# EAGLE design m1-program-counter (EAGLE 9.5.2)
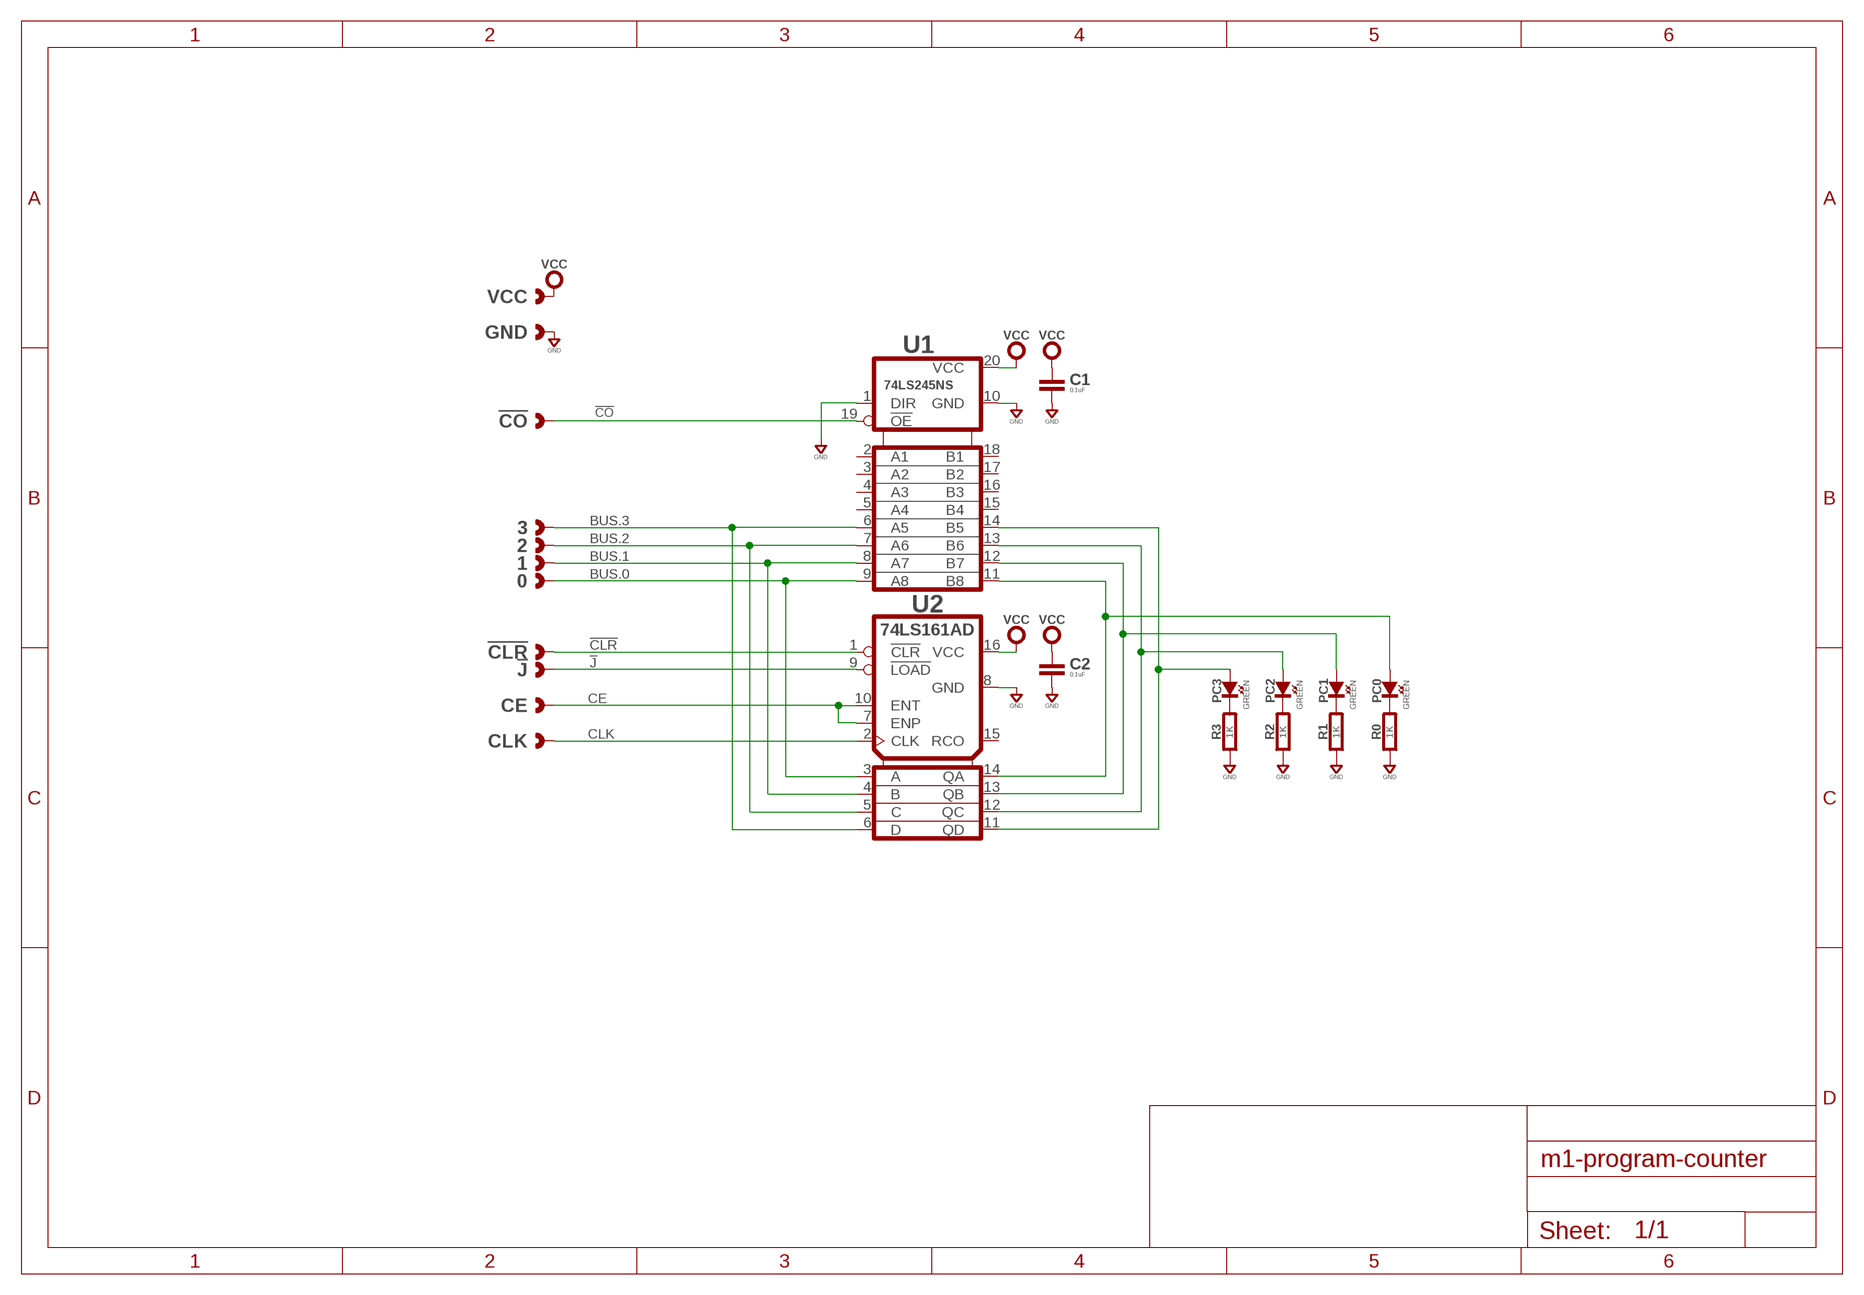
[diagram p0: schematic, sheet 1]

## Parts
0  CAST-01X1  [CAST01-2.54MM]
1  CAST-01X1  [CAST01-2.54MM]
2  CAST-01X1  [CAST01-2.54MM]
3  CAST-01X1  [CAST01-2.54MM]
!CLR  CAST-01X1  [CAST01-2.54MM]
!CO  CAST-01X1  [CAST01-2.54MM]
!J  CAST-01X1  [CAST01-2.54MM]
C1  0.1uF  CAPACITOR0603  [0603-CAP]
C2  0.1uF  CAPACITOR0603  [0603-CAP]
CE  CAST-01X1  [CAST01-2.54MM]
CLK  CAST-01X1  [CAST01-2.54MM]
GND  CAST-01X1  [CAST01-2.54MM]
PC0  GREEN  SMT0603  [SMD_0603]
PC1  GREEN  SMT0603  [SMD_0603]
PC2  GREEN  SMT0603  [SMD_0603]
PC3  GREEN  SMT0603  [SMD_0603]
R0  1K  RESISTOR0603  [0603-RES]
R1  1K  RESISTOR0603  [0603-RES]
R2  1K  RESISTOR0603  [0603-RES]
R3  1K  RESISTOR0603  [0603-RES]
U1  74LS245NS  [SO20]
U2  74LS161AD  [SO16]
VCC  CAST-01X1  [CAST01-2.54MM]

## Nets
!CLR: !CLR.1 U2.1(!CLR)
!CO: !CO.1 U1.19(!OE)
!J: !J.1 U2.9(!LOAD)
BUS.0: 0.1 U1.9(A8) U2.3(A)
BUS.1: 1.1 U1.8(A7) U2.4(B)
BUS.2: 2.1 U1.7(A6) U2.5(C)
BUS.3: 3.1 U1.6(A5) U2.6(D)
CE: CE.1 U2.7(ENP) U2.10(ENT)
CLK: CLK.1 U2.2(CLK)
GND: C1.2 C2.2 GND.1 R0.1 R1.1 R2.1 R3.1 U1.1(DIR) U1.10(GND) U2.8(GND)
N$1: PC0.A U1.11(B8) U2.14(QA)
N$2: PC1.A U1.12(B7) U2.13(QB)
N$3: PC2.A U1.13(B6) U2.12(QC)
N$4: PC3.A U1.14(B5) U2.11(QD)
N$9: PC0.K(C) R0.2
N$15: PC1.K(C) R1.2
N$16: PC2.K(C) R2.2
N$17: PC3.K(C) R3.2
VCC: C1.1 C2.1 U1.20(VCC) U2.16(VCC) VCC.1
Unconnected: U1.2(A1) U1.3(A2) U1.4(A3) U1.5(A4) U1.15(B4) U1.16(B3) U1.17(B2) U1.18(B1) U2.15(RCO)

## Library data of the parts
0 1-3 !CLR !CO !J CE CLK GND VCC = con-headers:CAST-01X1: Castelated Edge Hole Pad
C1 C2 = rlc:CAPACITOR: Capacitor CAP
PC0 PC1-PC3 = led:SMT: LED SMT
R0 R1-R3 = rlc:RESISTOR: Resistor
U1 = logic:74*245?: 74245 Octal Transceiver
U2 = logic:74*161A?: Synchronous 4-bit Counter

## Board
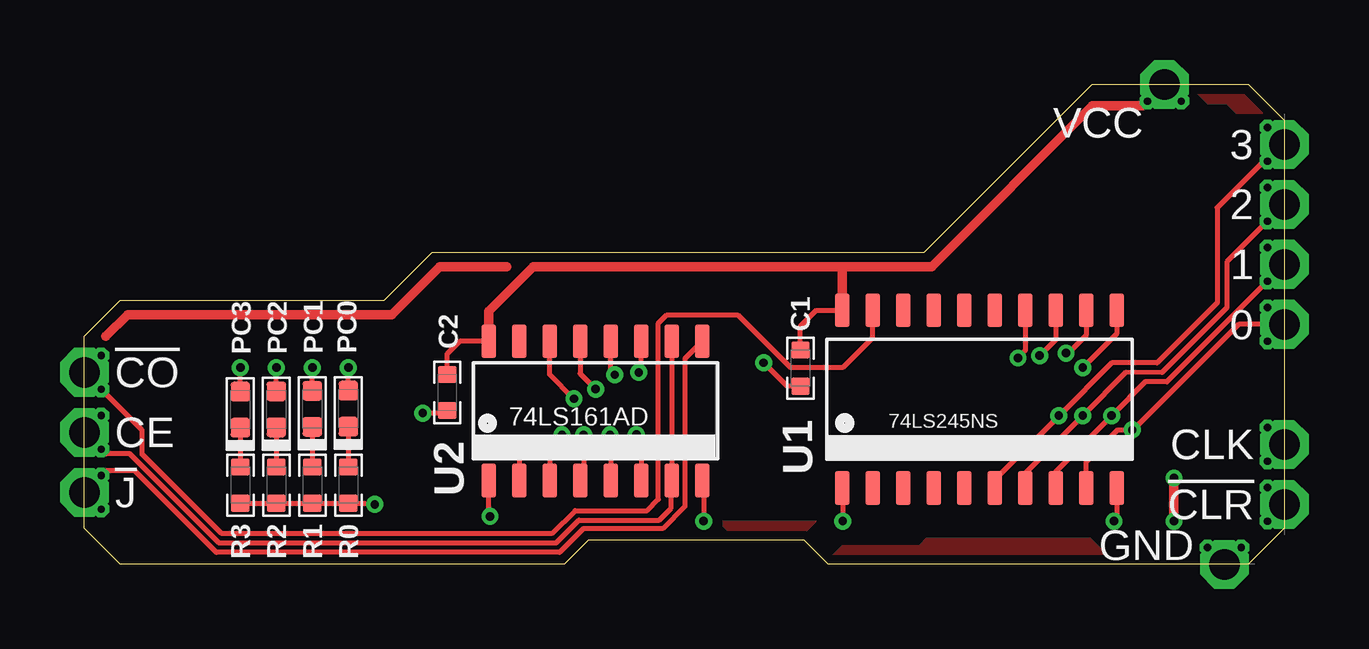
[diagram p1: board, top side]
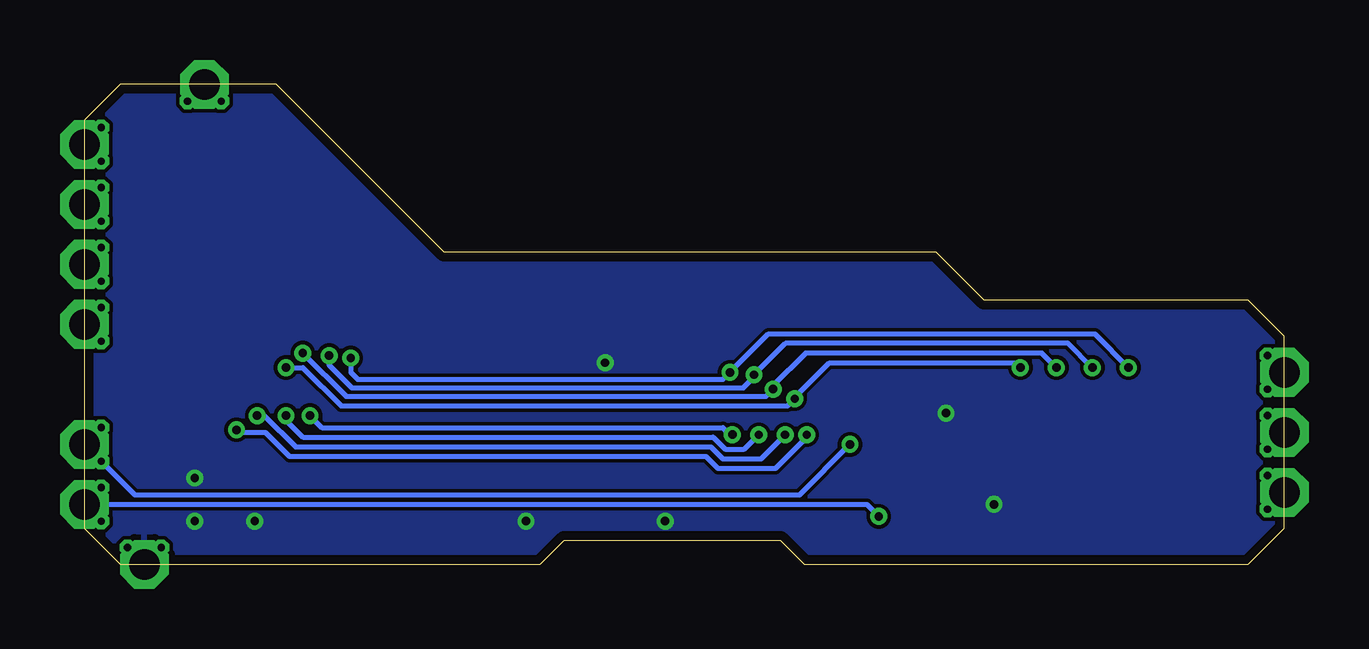
[diagram p2: board, bottom side, seen from below]

Size 50 x 20 mm. Coordinates in mm from the lower left corner, seen from the top.
Outline: 48.5,0 47.5,0 31,0 30,1 21,1 20,0 1.5,0 0,1.5 0,3 0,5.5 0,8 0,9.5 1.5,11 12.5,11 14.5,13 35,13 42,20 45,20 48.5,20 50,18.5 50,17.5 50,15 50,12.5 50,10 50,5 50,2.5 50,1.5 48.5,0
Copper layers (1*16): Top 0.0356mm / dielectric 1.5011mm / Bottom 0.0356mm
Design rules "OSH-CircuitMonkey *": minimum track width 6mil, minimum drill 13mil, track to track 6mil, track to pad 6mil, pad to pad 6mil, via to via 6mil, smd to smd 6mil, copper to edge 15mil, drill to drill 6mil, minimum pad ring 7mil, minimum via ring 7mil, stop-mask expansion 3mil, vias tented up to drill 14mil, thermal gap 10mil

### Footprints (pad centres in the part's own frame; a part is rotated, then mirrored left to right if it is on the bottom)
CAST01-2.54MM = drill 1.27 pad 2.032 octagon: 1 0,0 | drill 0.305 octagon: P$1 -0.7,0.7; P$2 -0.7,-0.7
0603-CAP = smd 0.711 x 0.762: 1 -0.752,0; 2 0.752,0
SMD_0603 = smd 0.8 x 0.8: A 0.75,0; K -0.75,0
0603-RES = smd 0.711 x 0.762: 1 -0.752,0; 2 0.752,0
SO20 = smd 0.6 x 1.4: 1 -5.715,-3.7; 2 -4.445,-3.7; 3 -3.175,-3.7; 4 -1.905,-3.7; 5 -0.635,-3.7; 6 0.635,-3.7; 7 1.905,-3.7; 8 3.175,-3.7; 9 4.445,-3.7; 10 5.715,-3.7; 11 5.715,3.7; 12 4.445,3.7; 13 3.175,3.7; 14 1.905,3.7; 15 0.635,3.7; 16 -0.635,3.7; 17 -1.905,3.7; 18 -3.175,3.7; 19 -4.445,3.7; 20 -5.715,3.7
SO16 = smd 0.6 x 1.4: 1 -4.445,-2.9; 2 -3.175,-2.9; 3 -1.905,-2.9; 4 -0.635,-2.9; 5 0.635,-2.9; 6 1.905,-2.9; 7 3.175,-2.9; 8 4.445,-2.9; 9 4.445,2.9; 10 3.175,2.9; 11 1.905,2.9; 12 0.635,2.9; 13 -0.635,2.9; 14 -1.905,2.9; 15 -3.175,2.9; 16 -4.445,2.9

### Placement (x,y rotation side)
0  50,10 0 top
1  50,12.5 0 top
2  50,15 0 top
3  50,17.5 0 top
!CLR  50,2.5 0 top
!CO  0,8 180 top
!J  0,3 180 top
C1  29.84,8.18 270 top
C2  15.12,7.16 270 top
CE  0,5.5 180 top
CLK  50,5 0 top
GND  47.5,0 270 top
PC0  11,6.49 90 top
PC1  9.5,6.48 90 top
PC2  8,6.46 90 top
PC3  6.5,6.45 90 top
R0  11,3.3 90 top
R1  9.5,3.3 90 top
R2  8,3.3 90 top
R3  6.5,3.3 90 top
U1  37.29,6.89 0 top
U2  21.29,6.4 0 top
VCC  45,20 90 top

### Tracks (layer width: path | path; a pad name or v marks a point on that pad's centre or on a via)
!CLR  (via drill 0.35)
  Top 0.2: v16.9,2 16.85,2.05 U2.1
  Bottom 0.2: !CLR.1 17.4,2.5 v16.9,2
!CO
  Top 0.2: !CO.1 2.4,5.6 2.4,4.6 5.7,1.3 19.5,1.3 20.44,2.24 23.45,2.24 23.91,2.71 23.91,10.05 24.27,10.4 27.22,10.4 29.41,8.22 31.62,8.22 32.85,9.45 U1.19
!J
  Top 0.2: U2.9 25.02,8.58 25.02,2.42 24.09,1.49 20.79,1.49 19.8,0.5 5.5,0.5 2.1,3.9 0.9,3.9 !J.1
AAA
  pour Top: 26.8,1.4 30.1,1.4 30.5,1.8 26.6,1.8 26.6,1.6
BBB
  pour Top: 49.1,18.8 48.3,19.6 46.4,19.6 46.8,19.2 47.6,19.2 48,18.8
BUS.0  (via drill 0.35)
  Top 0.2: 0.1 48.1,10 43.7,5.61 v43.66,5.61 43.06,5.61 41.74,4.28 U1.9 | v19.9,5.4 19.39,4.89 U2.3
  Bottom 0.2: v43.66,5.61 43.56,5.5 42.46,5.5 41.46,4.5 24.1,4.5 23.6,4 21.2,4 19.9,5.3 v19.9,5.4
BUS.1  (via drill 0.35)
  Top 0.2: 1.1 45.1,7.6 44.2,7.6 v42.8,6.2 40.49,3.89 40.49,3.21 U1.8 | v20.8,5.4 20.8,3.64 U2.4
  Bottom 0.2: v42.8,6.2 42.5,6.2 41.2,4.9 23.9,4.9 23.4,4.4 21.8,4.4 v20.8,5.4
BUS.2  (via drill 0.35)
  Top 0.2: 2.1 47.6,12.6 47.6,10.7 44.89,7.99 43.4,8 v41.6,6.2 39.2,3.8 U1.7 | v21.9,5.4 21.93,5.37 U2.5
  Bottom 0.2: v41.6,6.2 41.6,6 40.9,5.3 23.8,5.3 23.3,4.8 22.5,4.8 v21.9,5.4
BUS.3  (via drill 0.35)
  Top 0.2: 3.1 49.84,17.5 47.2,14.86 47.2,10.9 44.7,8.4 42.81,8.4 40.61,6.2 | 40.61,6.2 37.9,3.49 37.9,3.21 U1.6 | v40.6,6.2 40.61,6.2 | v23,5.41 23.2,5.21 U2.6
  Bottom 0.2: v40.6,6.2 40.1,5.7 23.39,5.7 23.1,5.41 v23,5.41
CE
  Top 0.2: CE.1 0.9,4.6 1.9,4.6 5.61,0.9 19.65,0.9 20.6,1.84 23.95,1.84 24.45,2.34 24.45,3.48 U2.7 U2.10
CLK  (via drill 0.35)
  Top 0.2: v18.1,5 18.12,4.98 U2.2
  Bottom 0.2: CLK.1 47.9,2.9 20.2,2.9 v18.1,5
GND  (via drill 0.35)
  Top 0.2: C2.2 15.01,6.3 v14.1,6.3 | v28.3,8.4 29.28,7.42 C1.2 | U1.1 31.6,3.17 v31.6,1.8 | U2.8 25.8,3.43 v25.8,1.8 | U1.10 43.01,1.91 v42.9,1.8 | R3.1 R2.1 R1.1 R0.1 12.05,2.55 v12.1,2.5
  Top 0.4: v45.4,3.6 v45.4,1.8
  pour Bottom: 1.5,0 0,1.5 0,9.5 1.5,11 12.5,11 14.5,13 35,13 42,20 48.5,20 50,18.5 50,1.5 48.5,0 31,0 30,1 21,1 20,0
N$1  (via drill 0.35)
  Top 0.2: U1.11 43.01,9.61 v41.6,8.2 | v20.4,6.9 19.39,7.91 U2.14 | PC0.A v11,8.2
  Bottom 0.2: v41.6,8.2 40.9,8.2 39.3,6.6 20.7,6.6 v20.4,6.9 20.4,6.96 18.96,8.4 11.2,8.4 v11,8.2
N$2  (via drill 0.35)
  Top 0.2: U1.12 41.74,9.54 40.9,8.7 v40.9,8.8 | U2.13 20.66,7.94 v21.3,7.3 | PC1.A v9.5,8.2
  Bottom 0.2: v40.9,8.8 39.09,7 21.6,7 v21.3,7.3 21.3,7.46 19.95,8.8 10.11,8.8 v9.5,8.2
N$3  (via drill 0.35)
  Top 0.2: U1.13 40.47,9.37 v39.8,8.7 | v22.1,7.9 21.93,8.07 U2.12 | PC2.A v8,8.2
  Bottom 0.2: v39.8,8.7 39.8,8.3 38.86,7.36 22.54,7.36 22.1,7.8 v22.1,7.9 20.8,9.21 9.01,9.21 v8,8.2
N$4  (via drill 0.35)
  Top 0.2: U1.14 39.2,8.9 v38.9,8.6 | v23.1,8 23.2,8.1 U2.11 | PC3.A v6.5,8.2
  Bottom 0.2: v38.9,8.6 38.9,8 38.61,7.71 23.39,7.71 v23.1,8 21.5,9.6 7.9,9.6 v6.5,8.2
N$5
  Top 0.4: 17.6,12.4 14.8,12.4 12.8,10.4 1.8,10.4 0.9,9.5
N$9
  Top 0.2: PC0.K R0.2
N$15
  Top 0.2: PC1.K R1.2
N$16
  Top 0.2: PC2.K R2.2
N$17
  Top 0.2: PC3.K R3.2
NNN
  pour Top: 42.6,0.4 31.2,0.4 31.6,0.8 34.8,0.8 35.1,1.1 41.9,1.1
VCC
  Top 0.2: C1.1 29.84,9.93 30.5,10.59 U1.20
  Top 0.203: C2.1 15.12,8.77 15.65,9.3 U2.16
  Top 0.4: VCC.1 44.1,19.1 42,19.1 35.3,12.4 31.7,12.4 | 31.7,12.4 18.7,12.4 16.85,10.55 U2.16 | U1.20 31.58,12.28 31.7,12.4

### Text on the board
tDocu: Vcc | 3 | 2 | 1 | 0 | !CO | CE | CLK | !J | !CLR | GND